# EasyEDA Pro project ProPrj_StarrySkyPi_2025-06-18.epro, schematic Schematic1, sheets 6 to 7 of 7

## Sheets
6 外部存储: Page Name: 外部存储
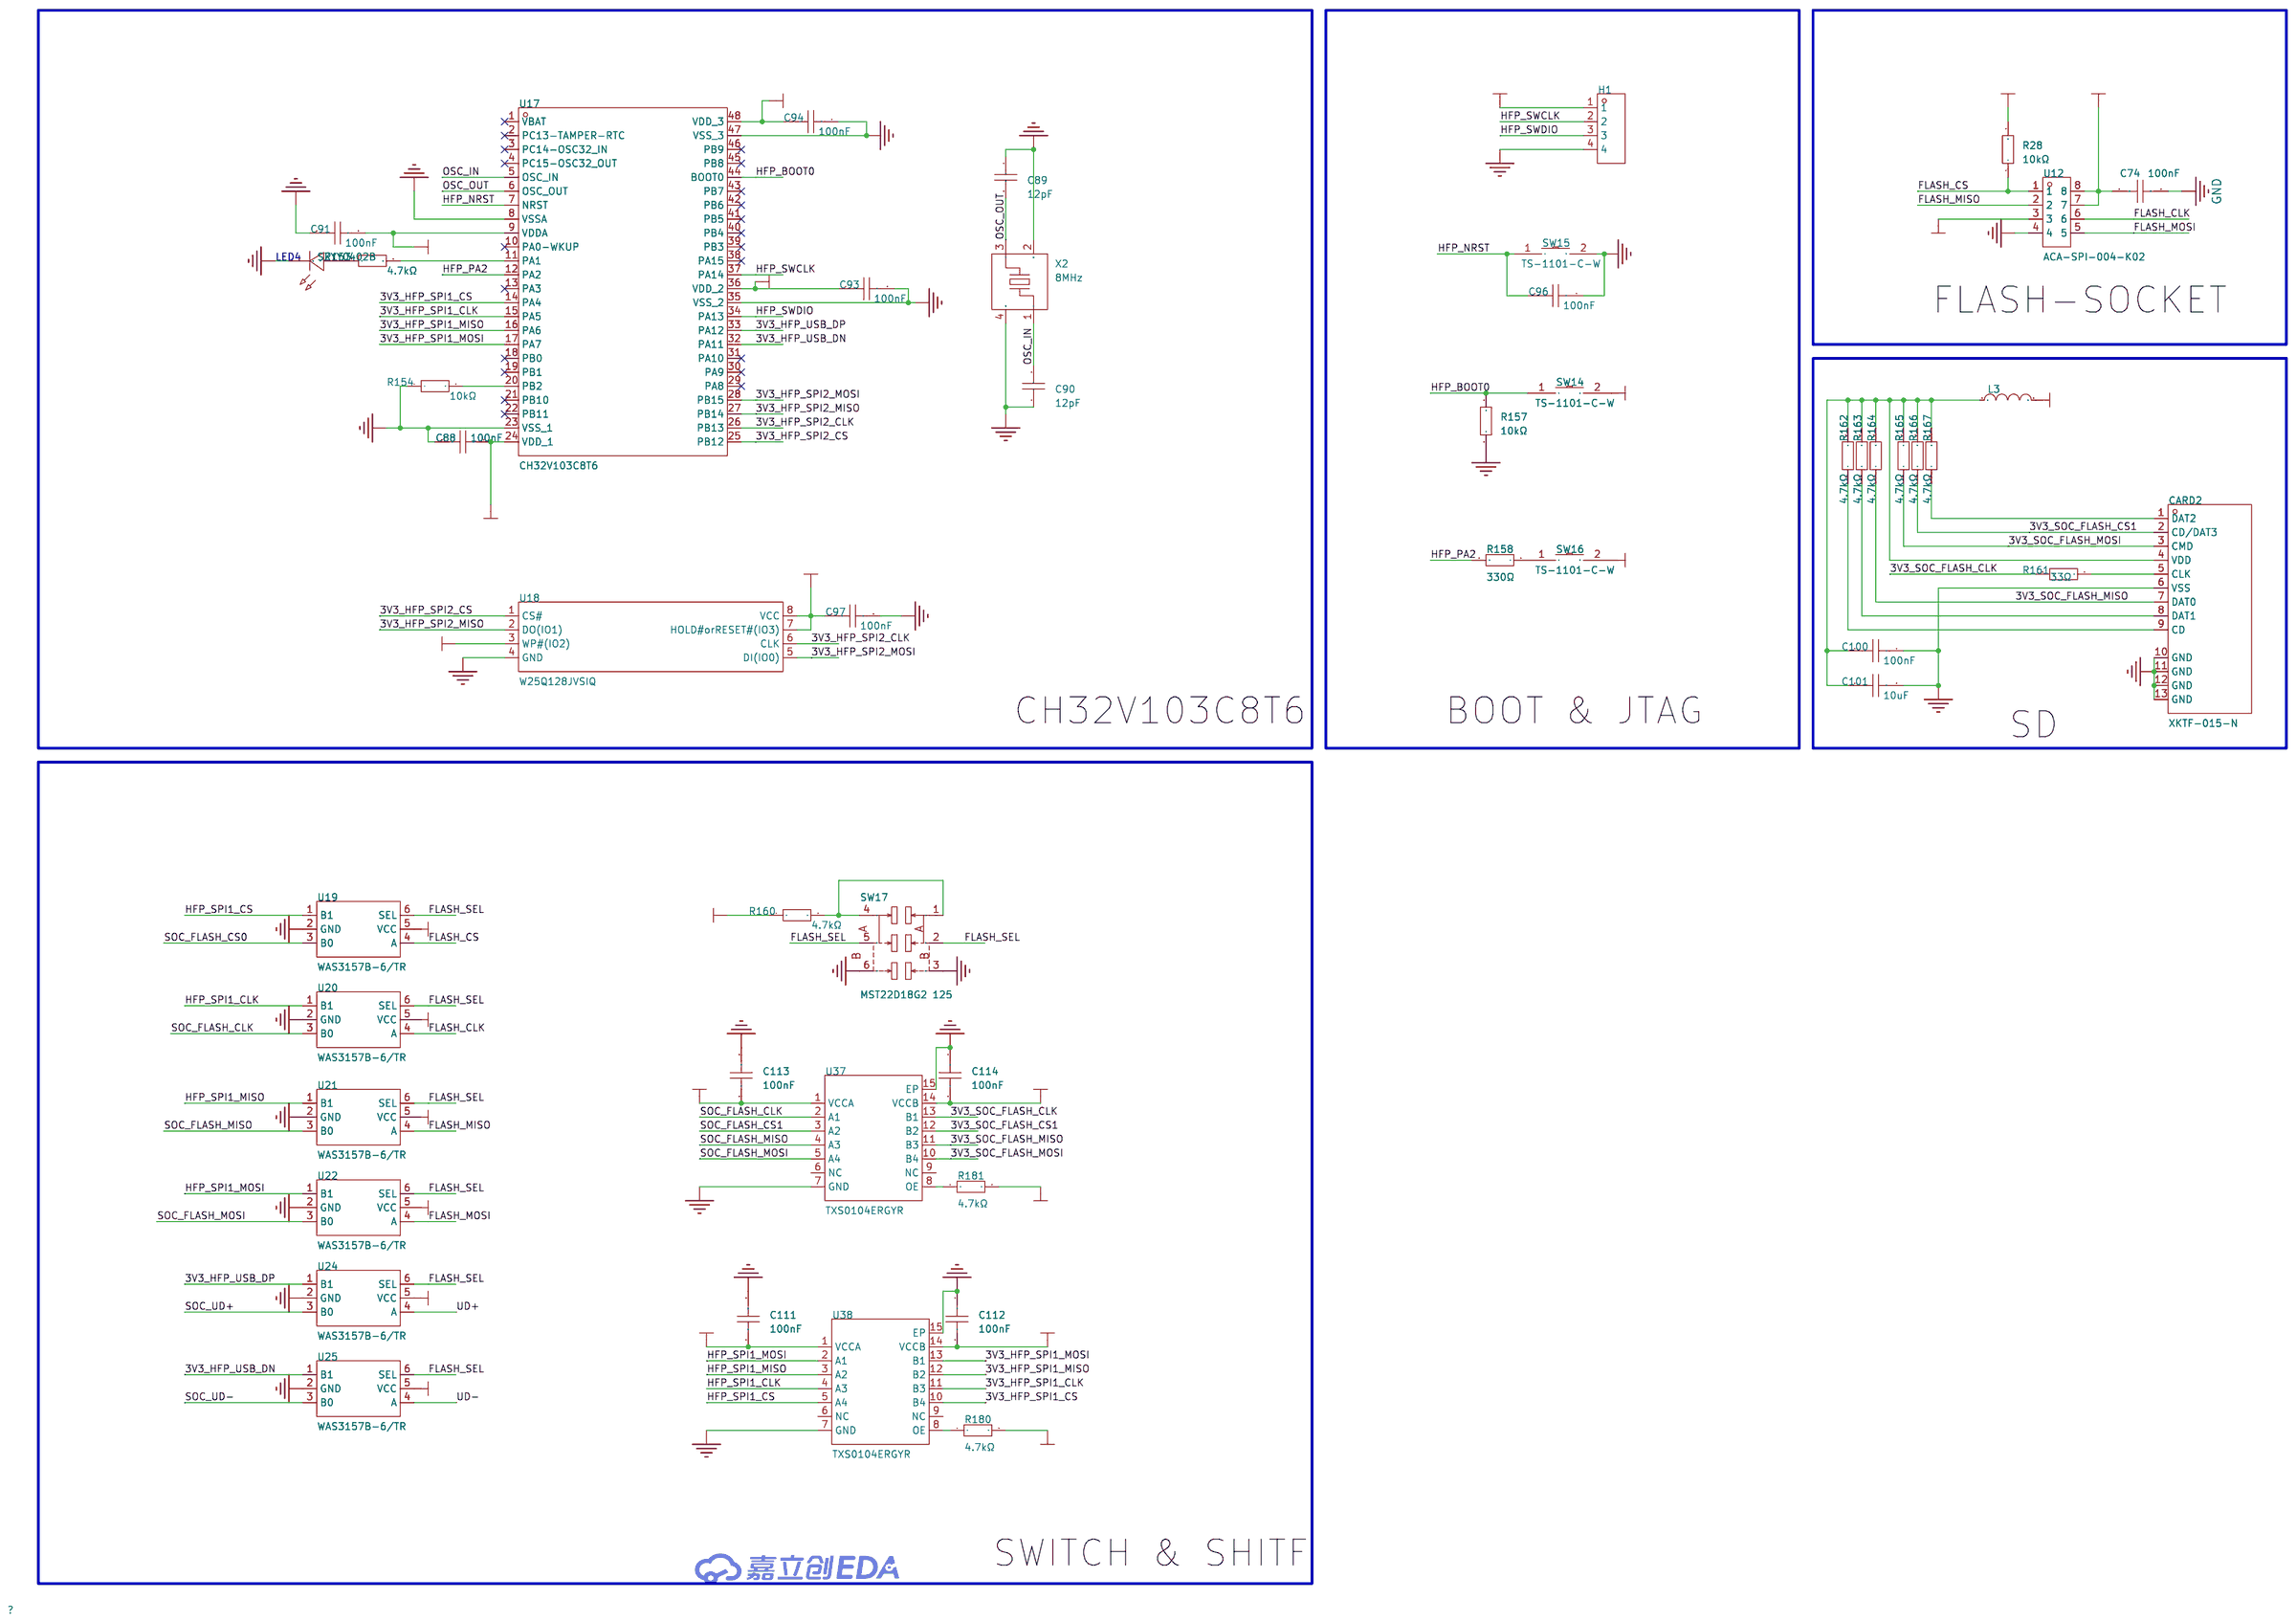
[diagram p5: 外部存储]
7 外设: Page Name: 外设; Update Date: 2025-06-11
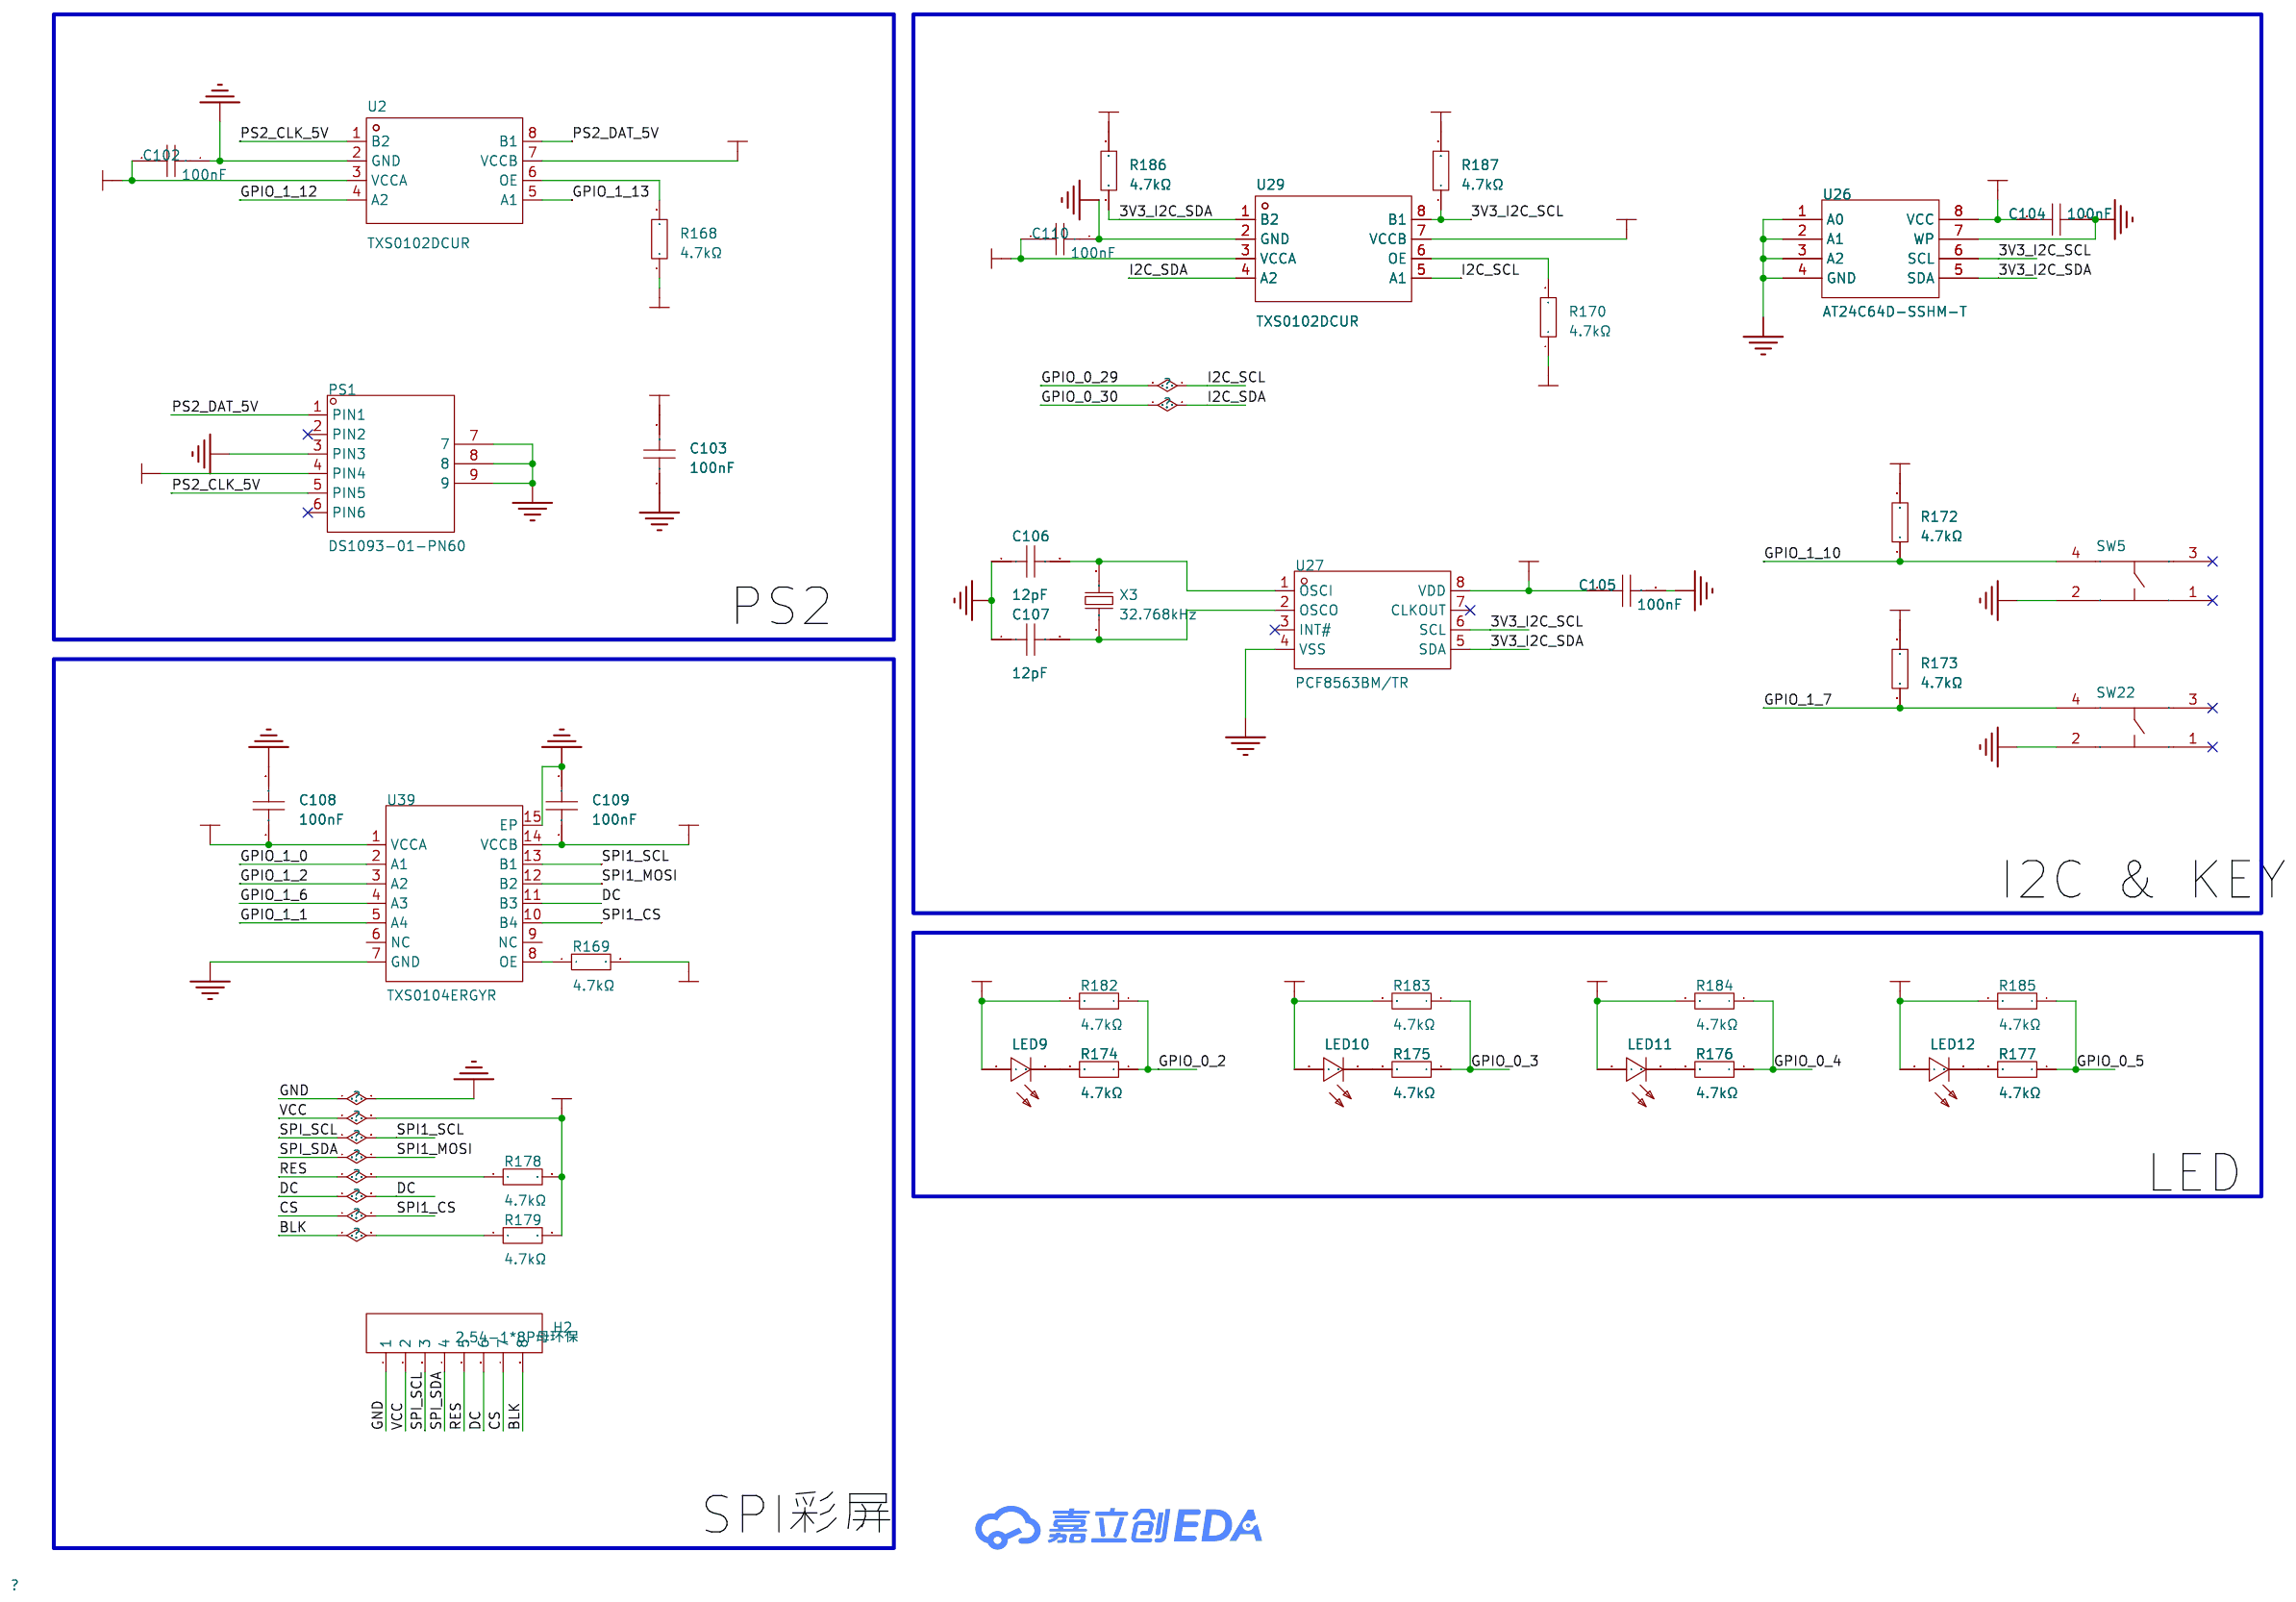
[diagram p6: 外设]

## Parts
sheet 外设
C102  100nF  [C0402]
C103  100nF  [C0402]
C104  100nF  [C0402]
C105  100nF  [C0402]
C106  12pF  [C0402]
C107  12pF  [C0402]
C108  100nF  [C0201]
C109  100nF  [C0201]
C110  100nF  [C0402]
H2  2.54-1*8P母环保  [HDR-TH_8P-P2.54-V-F-1]
LED9  19-213/Y2C-CQ2R2L/3T(CY)  [LED0603-RD-YELLOW]
LED10  19-213/Y2C-CQ2R2L/3T(CY)  [LED0603-RD-YELLOW]
LED11  19-213/Y2C-CQ2R2L/3T(CY)  [LED0603-RD-YELLOW]
LED12  19-213/Y2C-CQ2R2L/3T(CY)  [LED0603-RD-YELLOW]
PS1  DS1093-01-PN60  [CONN-TH_DS1093-01-PN60]
R168  4.7kΩ  [R0402]
R169  4.7kΩ  [R0201]
R170  4.7kΩ  [R0402]
R172  4.7kΩ  [R0402]
R173  4.7kΩ  [R0402]
R174  4.7kΩ  [R0402]
R175  4.7kΩ  [R0402]
R176  4.7kΩ  [R0402]
R177  4.7kΩ  [R0402]
R178  4.7kΩ  [R0201]
R179  4.7kΩ  [R0201]
R182  4.7kΩ  [R0402]
R183  4.7kΩ  [R0402]
R184  4.7kΩ  [R0402]
R185  4.7kΩ  [R0402]
R186  4.7kΩ  [R0402]
R187  4.7kΩ  [R0402]
SW5  PTS810SJM250SMTRLFS  [KEY-SMD_4P-L4.2-W3.2-P2.20-LS4.6]
SW22  PTS810SJM250SMTRLFS  [KEY-SMD_4P-L4.2-W3.2-P2.20-LS4.6]
U2  TXS0102DCUR  [VSON8_L2.0-W2.3-P0.50-LS3.1-BL]
U26  AT24C64D-SSHM-T  [SOIC-8_L5.0-W4.0-P1.27-LS6.0-BL]
U27  PCF8563BM/TR  [SOP-8_L4.9-W3.9-P1.27-LS6.0-BL]
U29  TXS0102DCUR  [VSON8_L2.0-W2.3-P0.50-LS3.1-BL]
U39  TXS0104ERGYR  [VQFN-14_L3.5-W3.5-P0.50-BL-EP]
X3  32.768kHz  [FC-135R_L3.2-W1.5]
sheet 外部存储
C74  100nF  [C0603]
C88  100nF  [C0402]
C89  12pF  [C0402]
C90  12pF  [C0402]
C91  100nF  [C0402]
C93  100nF  [C0402]
C94  100nF  [C0402]
C96  100nF  [C0402]
C97  100nF  [C0402]
C100  100nF  [C0402]
C101  10uF  [C0402]
C111  100nF  [C0201]
C112  100nF  [C0201]
C113  100nF  [C0201]
C114  100nF  [C0201]
CARD2  XKTF-015-N  [TF-SMD_XKTF-015-N]
H1  -  [HDR-TH_4P-P2.54-V-F]
L3  CBW201209U601T  [L0805]
LED4  SZYY0402B  [LED0402-RD_BLUE]
R28  10kΩ  [R0603]
R153  4.7kΩ  [R0603]
R154  10kΩ  [R0402]
R157  10kΩ  [R0603]
R158  330Ω  [R0603]
R160  4.7kΩ  [R0603]
R161  33Ω  [R0402]
R162  4.7kΩ  [R0402]
R163  4.7kΩ  [R0402]
R164  4.7kΩ  [R0402]
R165  4.7kΩ  [R0402]
R166  4.7kΩ  [R0402]
R167  4.7kΩ  [R0402]
R180  4.7kΩ  [R0201]
R181  4.7kΩ  [R0201]
SW14  TS-1101-C-W  [SW-SMD_L6.0-W3.3-LS8.0]
SW15  TS-1101-C-W  [SW-SMD_L6.0-W3.3-LS8.0]
SW16  TS-1101-C-W  [SW-SMD_L6.0-W3.3-LS8.0]
SW17  MST22D18G2 125  [SW-SMD_MST22D18G2]
U12  ACA-SPI-004-K02  [CONN-SMD_ACA-SPI-004-K02]
U17  CH32V103C8T6  [LQFP-48_48P-L7.0-W7.0-P0.50-LS9.0-BL]
U18  W25Q128JVSIQ  [SOIC-8_L5.3-W5.3-P1.27-LS8.0-BL]
U19  WAS3157B-6/TR  [SOT-363_L2.0-W1.3-P0.65-LS2.1-BL]
U20  WAS3157B-6/TR  [SOT-363_L2.0-W1.3-P0.65-LS2.1-BL]
U21  WAS3157B-6/TR  [SOT-363_L2.0-W1.3-P0.65-LS2.1-BL]
U22  WAS3157B-6/TR  [SOT-363_L2.0-W1.3-P0.65-LS2.1-BL]
U24  WAS3157B-6/TR  [SOT-363_L2.0-W1.3-P0.65-LS2.1-BL]
U25  WAS3157B-6/TR  [SOT-363_L2.0-W1.3-P0.65-LS2.1-BL]
U37  TXS0104ERGYR  [VQFN-14_L3.5-W3.5-P0.50-BL-EP]
U38  TXS0104ERGYR  [VQFN-14_L3.5-W3.5-P0.50-BL-EP]
X2  8MHz  [CRYSTAL-SMD_4P-L3.2-W2.5-BL]

## Library data of the parts
C96 C97 C100 C102-C105 C110 = CL05B104KO5NNNC: 容值:100nF;精度:±10%;额定电压:16V;材质(温度系数):X7R;; LCSC Part Name: 100nF ±10% 16V; Supplier Part: C1525; Manufacturer: SAMSUNG(三星); Supplier Footprint: 0402; JLCPCB Part Class: Basic Part; Datasheet: https://atta.szlcsc.com/upload/public/pdf/source/20160218/1457707763339.pdf; Supplier: LCSC; Tolerance: ±10%; Voltage Rated: 16V; Temperature Coefficient: X7R
C106 C107 = GRM1555C1H120JA01D: 容值:12pF;精度:±5%;额定电压:50V;温度系数:C0G;; LCSC Part Name: 12pF ±5% 50V; Supplier Part: C76948; Manufacturer: muRata(村田); Supplier Footprint: 0402; JLCPCB Part Class: Extended Part; Datasheet: https://atta.szlcsc.com/upload/public/pdf/source/20180307/C76948_15204091175261407736.pdf; Supplier: LCSC; Tolerance: ±5%; Voltage Rated: 50V; Temperature Coefficient: C0G; Voltage Rating: 50V
C108 C109 C111-C114 = GRM033R61E104KE14D: 容值:100nF;精度:±10%;额定电压:25V;材质(温度系数):X5R;; LCSC Part Name: 100nF ±10% 25V; Supplier Part: C76939; Manufacturer: muRata(村田); Supplier Footprint: 0201; JLCPCB Part Class: Extended Part; Datasheet: https://atta.szlcsc.com/upload/public/pdf/source/20180307/C76939_15204091018551407727.pdf; Supplier: LCSC; Tolerance: ±10%; Voltage Rated: 25V; Temperature Coefficient: X5R
H2 = 2.54-1*8P母环保: 插孔结构:1x8P;间距:2.54mm;行距:-;安装类型:直插;排数:单排;总孔位数:8P;塑高:-;触头材质:-;触头镀层:-;; LCSC Part Name: 间距:2.54mm 1x8P 直插; Supplier Part: C27438; Manufacturer: BOOMELE(博穆精密); Supplier Footprint: 插件,P=2.54mm; JLCPCB Part Class: Extended Part; Datasheet: https://atta.szlcsc.com/upload/public/pdf/source/20231221/1CA800C6799ED97958773716FAA1BFFE.pdf; Supplier: LCSC; Holes Structure: 1x8P; Pitch: 2.54mm; Mounting Type: 直插; Number of Rows: 单排; Number of Holes: 8P
LED9-LED12 = 19-213/Y2C-CQ2R2L/3T(CY): 发光颜色:黄色;功率:60mW;正向电流:20mA;主波长:585.5nm~591.5nm;二极管配置:-;透镜颜色:无色透明透镜;色温:-;发光角度:120°;载带方式:-;工作温度:-40℃~+85℃;; LCSC Part Name: 黄灯; Supplier Part: C72038; Manufacturer: EVERLIGHT(亿光); Supplier Footprint: 0603; JLCPCB Part Class: 基础库; Datasheet: https://atta.szlcsc.com/upload/public/pdf/source/20160507/1462613613586.pdf; Supplier: LCSC; Emitted Color: 黄色; Power Dissipation: 60mW; Forward Current: 20mA; Dominant Wavelength: 585.5nm~591.5nm; Peak Wavelength: 591nm; Lens Color: 无色透明透镜; Viewing Angle: 120°; Operating Temperature: -40℃~+85℃
PS1 = DS1093-01-PN60: LCSC Part Name: PS2鼠标插座 6Pin  紫色; Supplier Part: C77848; Manufacturer: CONNFLY; Supplier Footprint: 插件; JLCPCB Part Class: 扩展库; Datasheet: https://atta.szlcsc.com/upload/public/pdf/source/20160816/1471343007546.pdf; Supplier: LCSC
R162-R168 R170 R172-R177 R182-R187 = 0402WGF4701TCE: 电阻类型:厚膜电阻;阻值:4.7kΩ;精度:±1%;功率:62.5mW;最大工作电压:50V;温度系数:±100ppm/℃;; LCSC Part Name: 4.7kΩ ±1% 62.5mW 厚膜电阻; Supplier Part: C25900; Manufacturer: UNI-ROYAL(厚声); Supplier Footprint: 0402; JLCPCB Part Class: Basic Part; Datasheet: https://atta.szlcsc.com/upload/public/pdf/source/20200306/C422600_1E6D84923E4A46A82E41ADD87F860B5C.pdf; Supplier: LCSC; Type: 厚膜电阻; Tolerance: ±1%; Power(Watts): 62.5mW; Overload Voltage (Max): 50V; Temperature Coefficient: ±100ppm/℃; Operating Temperature Range: -55℃~+155℃
R169 R178-R181 = 0201WMF4701TEE: 电阻类型:厚膜电阻;阻值:4.7kΩ;精度:±1%;功率:50mW;最大工作电压:25V;温度系数:±200ppm/℃;; LCSC Part Name: 4.7kΩ ±1% 50mW 厚膜电阻; Supplier Part: C270346; Manufacturer: UNI-ROYAL(厚声); Supplier Footprint: 0201; JLCPCB Part Class: Extended Part; Datasheet: https://atta.szlcsc.com/upload/public/pdf/source/20200306/C422600_1E6D84923E4A46A82E41ADD87F860B5C.pdf; Supplier: LCSC; Type: 厚膜电阻; Tolerance: ±1%; Power(Watts): 50mW; Overload Voltage (Max): 25V; Temperature Coefficient: ±200ppm/℃; Operating Temperature Range: -55℃~+155℃
SW5 SW22 = PTS810SJM250SMTRLFS: 电路结构:单刀单掷;按钮形状:圆形按钮;作用力:1.6N;安装方式:立贴;开关长度:4.2mm;开关宽度:3.2mm;开关高度:2.5mm;触点电流:50mA;额定电压(DC):16V;带灯:-;机械寿命:-;; LCSC Part Name: 4.2*3.2*2.5mm 立贴 轻触开关; Supplier Part: C116501; Manufacturer: C&K; Supplier Footprint: SMD; JLCPCB Part Class: Extended Part; Datasheet: https://atta.szlcsc.com/upload/public/pdf/source/20180613/C221897_9316320DEFA4333FA0E6C5D565B0D5EA.pdf; Supplier: LCSC; Circuit: 单刀单掷; Actuator Style: 圆形按钮; Operating Force: 1.6N; Mounting Style: 立贴; Switch Length: 4.2mm; Switch Width: 3.2mm; Switch Height: 2.5mm; Contact Current: 50mA; Voltage Rating (DC): 16V; Pin Style: J型引脚; Operating Temperature: -40℃~+85℃
U2 U29 = TXS0102DCUR: 数据速率:24Mbps;电压(VCCA):1.65V~3.6V;电压(VCCB):2.3V~5.5V;电路数:1;每个电路通道数:2;; LCSC Part Name: 24Mbps 2位双向电平转换器; Supplier Part: C53434; Manufacturer: TI(德州仪器); Supplier Footprint: VSSOP-8; JLCPCB Part Class: 扩展库; Datasheet: https://www.ti.com/cn/lit/gpn/txs0102; Supplier: LCSC; Channel Type: 双向; Data Rate: 24Mbps; Supply Voltage (VCCA): 1.65V~3.6V; Supply Voltage (VCCB): 2.3V~5.5V; Number of Circuits: 1; Channels per Circuit: 2; Output Type: 开路漏极；推挽式; Operating Temperature: -40℃~+85℃; Features: 自动方向检测
U26 = AT24C64D-SSHM-T: 接口类型:I2C;存储容量:64Kbit;; Supplier Part: C6487; Manufacturer: MICROCHIP(美国微芯); Supplier Footprint: SOIC-8; JLCPCB Part Class: 扩展库; Datasheet: https://atta.szlcsc.com/upload/public/pdf/source/20150124/1457707264683.pdf; Supplier: LCSC; Interface Type: I2C; Memory Size: 64Kbit; Supply Voltage: 1.7V~5.5V; Operating Temperature: -40℃~+85℃
U27 = PCF8563BM/TR: Supplier Part: C5116334; Manufacturer: HGSEMI(华冠); Supplier Footprint: SOP-8; JLCPCB Part Class: 扩展库; Datasheet: https://atta.szlcsc.com/upload/public/pdf/source/20220822/3E6CA443E66F300D2C1AD287348F18D3.pdf; Supplier: LCSC
U37-U39 = TXS0104ERGYR: TXS0104E 用于漏极开路应用的 4 位双向电压电平转换器; Supplier Part: C154926; Manufacturer: TI(德州仪器); Supplier Footprint: VQFN-14-EP(3.5x3.5); JLCPCB Part Class: 扩展库; Datasheet: https://www.ti.com/cn/lit/gpn/txs0104e; Supplier: LCSC
X3 = Q13FC13500004_C32346: 晶振类型:贴片晶振;频率:32.768kHz;常温频差:±20ppm;负载电容:12.5pF;; LCSC Part Name: 32.768kHz ±20ppm 12.5pF; Supplier Part: C32346; Manufacturer: EPSON(爱普生); Manufacturer Part: Q13FC13500004; Supplier Footprint: SMD3215-2P; JLCPCB Part Class: 基础库; Datasheet: https://atta.szlcsc.com/upload/public/pdf/source/20240418/0E0FF5F0356BA3753F616001439D1416.pdf; Supplier: LCSC; Crystal Type: 贴片晶振; Normal temperature Frequency Tolerance: ±20ppm; Load Capacitor: 12.5pF; Equivalent Series Resistance (ESR): 70kΩ; Operating Temperature: -40℃~+85℃
C74 = CC0603KRX7R9BB104: 容值:100nF;精度:±10%;额定电压:50V;材质(温度系数):X7R;; LCSC Part Name: 100nF ±10% 50V; Supplier Part: C14663; Manufacturer: YAGEO(国巨); Supplier Footprint: 0603; JLCPCB Part Class: Basic Part; Datasheet: https://atta.szlcsc.com/upload/public/pdf/source/20180910/C282072_33301C7F631E79921B82A8DAC6BCC5B3.pdf; Supplier: LCSC; Tolerance: ±10%; Voltage Rated: 50V; Temperature Coefficient: X7R
C88 C91 C93 C94 = CC0402KRX7R7BB104: 容值:100nF;精度:±10%;额定电压:16V;材质(温度系数):X7R;; LCSC Part Name: 100nF ±10% 16V; Supplier Part: C60474; Manufacturer: YAGEO(国巨); Supplier Footprint: 0402; JLCPCB Part Class: Extended Part; Datasheet: https://atta.szlcsc.com/upload/public/pdf/source/20211223/9278FD768280B81DDBEF48FA36411A03.pdf; Supplier: LCSC; Tolerance: ±10%; Voltage Rated: 16V; Temperature Coefficient: X7R
C89 C90 = GRM1555C1H120JA01D: 容值:12pF;精度:±5%;额定电压:50V;材质(温度系数):C0G;; LCSC Part Name: 12pF ±5% 50V; Supplier Part: C76948; Manufacturer: muRata(村田); Supplier Footprint: 0402; JLCPCB Part Class: 扩展库; Datasheet: https://atta.szlcsc.com/upload/public/pdf/source/20180307/C76948_15204091175261407736.pdf; Supplier: LCSC; Tolerance: ±5%; Voltage Rated: 50V; Temperature Coefficient: C0G
C101 = CL05A106MQ5NUNC: 容值:10uF;精度:±20%;额定电压:6.3V;材质(温度系数):X5R;; LCSC Part Name: 10uF ±20% 6.3V; Supplier Part: C15525; Manufacturer: SAMSUNG(三星); Supplier Footprint: 0402; JLCPCB Part Class: Basic Part; Datasheet: https://atta.szlcsc.com/upload/public/pdf/source/20220823/2B02EE04F8F211D38A52DCB16EB6BEBA.pdf; Supplier: LCSC; Tolerance: ±20%; Voltage Rated: 6.3V; Temperature Coefficient: X5R
CARD2 = XKTF-015-N: 卡连接方式:自弹式;卡类型:MicroSD卡(TF卡);连接器类型:卡座;本体最大高度:2mm;工作温度范围:-25℃~+90℃;; LCSC Part Name: 自弹式 MicroSD卡(TF卡) 卡座; Supplier Part: C381082; Manufacturer: XKB Connection(中国星坤); Supplier Footprint: SMD; JLCPCB Part Class: 扩展库; Datasheet: https://atta.szlcsc.com/upload/public/pdf/source/20211011/66E84C7106D817B4016DBCE6B64BEDA0.pdf; Supplier: LCSC; Card Connection Mode: 自弹式; Card Type: MicroSD卡(TF卡); Connector Type: 卡座; Maximum Body Height: 2mm; Operating Temperature Range: -25℃~+90℃
H1 = HDR-F_2.54_1x4P: Supplier Part: C2718488; Supplier Footprint: 插件
L3 = CBW201209U601T: 标称阻抗@测试频率:600Ω@100MHz;误差:±25%;直流电阻(RDC):250mΩ;; LCSC Part Name: 单路 0805磁珠 阻抗600Ω@100MHz; Supplier Part: C21286; Manufacturer: FH(风华); Supplier Footprint: 0805; JLCPCB Part Class: 扩展库; Datasheet: https://atta.szlcsc.com/upload/public/pdf/source/20190129/C361676_507080CDC8DBC2B0B7C2139C1873642D.pdf; Supplier: LCSC; Impedance @ Frequency: 600Ω@100MHz; Tolerance: ±25%; DC Resistance: 250mΩ; Current Rating: 1.5A; Circuits: 1
LED4 = SZYY0402B: 发光颜色:蓝色;功率:-;正向电流:5mA;主波长:466nm~469nm;色温:-;发光角度:120°;载带方式:-;工作温度:-40℃~+85℃;; LCSC Part Name: 蓝灯; Supplier Part: C434447; Manufacturer: yongyu(永裕光电); Supplier Footprint: 0402; JLCPCB Part Class: Extended Part; Datasheet: https://atta.szlcsc.com/upload/public/pdf/source/20210222/C434447_30232BB6183B52026028ECA50B9DAB35.pdf; Supplier: LCSC; Emitted Color: 蓝色; Forward Current: 5mA; Dominant Wavelength: 466nm~469nm; Viewing Angle: 120°; Operating Temperature: -40℃~+85℃
R28 R157 = 0603WAF1002T5E: 电阻类型:厚膜电阻;阻值:10kΩ;精度:±1%;功率:100mW;最大工作电压:75V;温度系数:±100ppm/℃;; LCSC Part Name: 厚膜电阻 10kΩ ±1% 100mW; Supplier Part: C25804; Manufacturer: UNI-ROYAL(厚声); Supplier Footprint: 0603; JLCPCB Part Class: Basic Part; Datasheet: https://atta.szlcsc.com/upload/public/pdf/source/20200306/C422600_1E6D84923E4A46A82E41ADD87F860B5C.pdf; Supplier: LCSC; Type: 厚膜电阻; Tolerance: ±1%; Power(Watts): 100mW; Overload Voltage (Max): 75V; Temperature Coefficient: ±100ppm/℃; Operating Temperature Range: -55℃~+155℃
R153 R160 = 0603WAF4701T5E: 电阻类型:厚膜电阻;阻值:4.7kΩ;精度:±1%;功率:100mW;最大工作电压:75V;温度系数:±100ppm/℃;; LCSC Part Name: 4.7kΩ ±1% 100mW 厚膜电阻; Supplier Part: C23162; Manufacturer: UNI-ROYAL(厚声); Supplier Footprint: 0603; JLCPCB Part Class: Basic Part; Datasheet: https://atta.szlcsc.com/upload/public/pdf/source/20200306/C422600_1E6D84923E4A46A82E41ADD87F860B5C.pdf; Supplier: LCSC; Type: 厚膜电阻; Tolerance: ±1%; Power(Watts): 100mW; Overload Voltage (Max): 75V; Temperature Coefficient: ±100ppm/℃; Operating Temperature Range: -55℃~+155℃
R154 = 0402WGF1002TCE: 电阻类型:厚膜电阻;阻值:10kΩ;精度:±1%;功率:62.5mW;最大工作电压:50V;温度系数:±100ppm/℃;; LCSC Part Name: 10kΩ ±1% 62.5mW 厚膜电阻; Supplier Part: C25744; Manufacturer: UNI-ROYAL(厚声); Supplier Footprint: 0402; JLCPCB Part Class: Basic Part; Datasheet: https://atta.szlcsc.com/upload/public/pdf/source/20200306/C422600_1E6D84923E4A46A82E41ADD87F860B5C.pdf; Supplier: LCSC; Type: 厚膜电阻; Tolerance: ±1%; Power(Watts): 62.5mW; Overload Voltage (Max): 50V; Temperature Coefficient: ±100ppm/℃; Operating Temperature Range: -55℃~+155℃
R158 = 0603WAF3300T5E: 电阻类型:厚膜电阻;阻值:330Ω;精度:±1%;功率:100mW;最大工作电压:75V;温度系数:±100ppm/℃;; LCSC Part Name: 330Ω ±1% 100mW 厚膜电阻; Supplier Part: C23138; Manufacturer: UNI-ROYAL(厚声); Supplier Footprint: 0603; JLCPCB Part Class: Basic Part; Datasheet: https://atta.szlcsc.com/upload/public/pdf/source/20200306/C422600_1E6D84923E4A46A82E41ADD87F860B5C.pdf; Supplier: LCSC; Type: 厚膜电阻; Tolerance: ±1%; Power(Watts): 100mW; Overload Voltage (Max): 75V; Temperature Coefficient: ±100ppm/℃; Operating Temperature Range: -55℃~+155℃
R161 = 0402WGF330JTCE: 电阻类型:厚膜电阻;阻值:33Ω;精度:±1%;功率:62.5mW;最大工作电压:50V;温度系数:±100ppm/℃;; LCSC Part Name: 33Ω ±1% 62.5mW 厚膜电阻; Supplier Part: C25105; Manufacturer: UNI-ROYAL(厚声); Supplier Footprint: 0402; JLCPCB Part Class: Basic Part; Datasheet: https://atta.szlcsc.com/upload/public/pdf/source/20200306/C422600_1E6D84923E4A46A82E41ADD87F860B5C.pdf; Supplier: LCSC; Type: 厚膜电阻; Tolerance: ±1%; Power(Watts): 62.5mW; Overload Voltage (Max): 50V; Temperature Coefficient: ±100ppm/℃; Operating Temperature Range: -55℃~+155℃
SW14-SW16 = TS-1101-C-W: 电路结构:单刀单掷;按钮形状:矩形按钮;作用力:260gf;安装方式:立贴;开关长度:6mm;开关宽度:3.6mm;开关高度:2.5mm;带支架:不带;触点电流:50mA;额定电压(AC):-;额定电压(DC):12V;额定功率:-;绝缘电阻:-;带灯:无;机械寿命:5万次;; LCSC Part Name: 6*3.6*2.5mm 立贴 轻触开关; Supplier Part: C318938; Manufacturer: XKB Connectivity(中国星坤); Supplier Footprint: SMD; JLCPCB Part Class: 扩展库; Datasheet: https://atta.szlcsc.com/upload/public/pdf/source/20200227/C318938_C2E53B1EEDE37D980A33616AC086DE53.pdf; Supplier: LCSC; Circuit: 单刀单掷; Actuator Style: 矩形按钮; Operating Force: 260gf; Mounting Style: 立贴; Switch Length: 6mm; Switch Width: 3.6mm; Switch Height: 2.5mm; Strike Gundam: 不带; Contact Current: 50mA; Voltage Rating (DC): 12V; Actuator/Cap Color: 白色带淡绿; With Lamp: 无; Mechanical Life: 5万次; Operating Temperature: -30℃~+85℃
SW17 = MST22D18G2 125: 电路结构:双刀双掷;安装方式:立贴;开关颜色:黑色;额定电流(DC):100mA;额定电压(DC):12V;机械寿命:1万次;; LCSC Part Name: 拨动开关/两档立式 6脚贴片 柄长2.0mm 大六立贴 9.1*3.5mm; Supplier Part: C2906280; Manufacturer: SHOU HAN(首韩); Supplier Footprint: SMD; JLCPCB Part Class: 扩展库; Datasheet: https://atta.szlcsc.com/upload/public/pdf/source/20211019/449AD4EDF23AADA7A5C4E3C063EDBB30.pdf; Supplier: LCSC; Circuit: 双刀双掷; Pin Style: 鸥翼型; Mounting Style: 立贴; Actuator Color: 黑色; Current Rating (DC): 100mA; Voltage Rating (DC): 12V; Mechanical Life: 1万次; Operating Temperature: -25℃~+70℃
U12 = ACA-SPI-004-K02: LCSC Part Name: SPI 连接器; Supplier Part: C962129; Manufacturer: LOTES(嘉澤端子); JLCPCB Part Class: 扩展库; Datasheet: https://atta.szlcsc.com/upload/public/pdf/source/20201125/C962129_3BCCA5D90998541809E80F476B537BA8.pdf; Supplier: LCSC
U17 = CH32V103C8T6: CPU内核:RISC-V;程序存储容量:64KB;RAM总容量:20KB;GPIO端口数量:37;工作电压范围:2.7V~5.5V;CPU最大主频:80MHz;程序存储器类型:FLASH;; Supplier Part: C2764428; Manufacturer: WCH(南京沁恒); Supplier Footprint: LQFP-48(7x7); JLCPCB Part Class: 扩展库; Datasheet: https://atta.szlcsc.com/upload/public/pdf/source/20210707/C2832145_C97F3FA8145C3B839C9866ABB94A77A4.pdf; Supplier: LCSC; CPU Core: RISC-V; Program Storage Size: 64KB; RAM Size: 20KB; GPIO Ports Number: 37; Operating Voltage Range: 2.7V~5.5V; CPU Maximum Speed: 80MHz; Program Memory Type: FLASH; Operating Temperature Range: -40℃~+85℃; ADC (Bit): 12bit; PWM (Bit): 16bit; 16Bit Timer: 4; UART/USART: 3; I2C: 2; SPI: 2; Internal Oscillator: 有
U18 = W25Q128JVSIQ_C113767: 接口类型:SPI;存储容量:128Mbit;; Supplier Part: C113767; Manufacturer: WINBOND(华邦); Supplier Footprint: SOIC-8-208mil; JLCPCB Part Class: 扩展库; Datasheet: https://atta.szlcsc.com/upload/public/pdf/source/20180329/C113767_097B64D788F6E3FFB2E9CB46CB6C1427.pdf; Supplier: LCSC; Interface: SPI; Memory Size: 128Mbit; Voltage - Supply: 2.7V~3.6V; Page Programming Time (Tpp): 3ms; Operating Temperature: -40℃~+85℃
U19-U22 U24 U25 = WAS3157B-6/TR: 开关电路:单刀双掷(SPDT);通道数:-;导通电阻:5.5Ω;; Supplier Part: C213161; Manufacturer: WILLSEMI(韦尔); Supplier Footprint: SOT-363; JLCPCB Part Class: 扩展库; Datasheet: https://atta.szlcsc.com/upload/public/pdf/source/20180420/C213161_6492DDD7A7717D1F18F3D7064F4D413D.pdf; Supplier: LCSC; Switch Circuit: 单刀双掷(SPDT); Voltage - Supply: 2.3V~5.5V; Turn-on time: 120ns; RDS(on): 5.5Ω; Turn-off time: 80ns; Operating Temperature: -40℃~+85℃
X2 = X32258MOB4SI: 晶振类型:贴片晶振;频率:8MHz;常温频差:±10ppm;负载电容:12pF;频率稳定度:±20ppm;; LCSC Part Name: 8MHz ±10ppm 12pF; Supplier Part: C2682775; Manufacturer: YXC(扬兴晶振); Supplier Footprint: SMD3225-4P; JLCPCB Part Class: 扩展库; Datasheet: https://atta.szlcsc.com/upload/public/pdf/source/20240329/19D5F850207469550BEB00D7DFEDBC7A.pdf; Supplier: LCSC; Type: 贴片晶振; Normal temperature Frequency Tolerance: ±10ppm; Load Capacitance: 12pF; Frequency Stability: ±20ppm; Equivalent Series Resistance(ESR): 150Ω; Operating Temperature: -40℃~+85℃

## Nets
3V3_HFP_SPI1_CLK: U17.15(PA5) U38.11(B3)
3V3_HFP_SPI1_CS: U17.14(PA4) U38.10(B4)
3V3_HFP_SPI1_MISO: U17.16(PA6) U38.12(B2)
3V3_HFP_SPI1_MOSI: U17.17(PA7) U38.13(B1)
3V3_HFP_SPI2_CLK: U17.26(PB13) U18.6(CLK)
3V3_HFP_SPI2_CS: U17.25(PB12) U18.1(CS#)
3V3_HFP_SPI2_MISO: U17.27(PB14) U18.2(DO(IO1))
3V3_HFP_SPI2_MOSI: U17.28(PB15) U18.5(DI(IO0))
3V3_HFP_USB_DN: U17.32(PA11) U25.1(B1)
3V3_HFP_USB_DP: U17.33(PA12) U24.1(B1)
3V3_I2C_SCL: R187.1 U26.6(SCL) U27.6(SCL) U29.8(B1)
3V3_I2C_SDA: R186.1 U26.5(SDA) U27.5(SDA) U29.1(B2)
3V3_SOC_FLASH_CLK: R161.2 U37.13(B1)
3V3_SOC_FLASH_CS1: CARD2.2(CD/DAT3) R166.1 U37.12(B2)
3V3_SOC_FLASH_MISO: CARD2.7(DAT0) R164.1 U37.11(B3)
3V3_SOC_FLASH_MOSI: CARD2.3(CMD) R165.1 U37.10(B4)
GND: C74.1 C88.2 C89.1 C90.1 C91.1 C93.2 C94.2 C96.2 C97.2 C100.2 C101.2 C102.1 C103.1 C104.1 C105.2 C106.1 C107.1 C108.2 C109.2 C110.1 C111.2 C112.2 C113.2 C114.2 CARD2.6(VSS) CARD2.10(GND) CARD2.11(GND) CARD2.12(GND) CARD2.13(GND) H1.4 H2.1 LED4.1(C) PS1.3(PIN3) PS1.7 PS1.8 PS1.9 R154.1 R157.1 SW5.2 SW15.2 SW17.3 SW17.6 SW22.2 U2.2(GND) U12.4 U17.8(VSSA) U17.23(VSS_1) U17.35(VSS_2) U17.47(VSS_3) U18.4(GND) U19.2(GND) U20.2(GND) U21.2(GND) U22.2(GND) U24.2(GND) U25.2(GND) U26.1(A0) U26.2(A1) U26.3(A2) U26.4(GND) U26.7(WP) U27.4(VSS) U29.2(GND) U37.7(GND) U37.15(EP) U38.7(GND) U38.15(EP) U39.7(GND) U39.15(EP) X2.2(GND) X2.4(GND) ; also on sheet 2 3 4 5
VCC_1V8: C74.2 C102.2 C108.1 C110.2 C111.1 C113.1 R28.2 R168.1 R169.2 R170.1 R172.2 R173.2 R180.2 R181.2 U2.3(VCCA) U12.3 U12.7 U12.8 U29.3(VCCA) U37.1(VCCA) U38.1(VCCA) U39.1(VCCA) ; also on sheet 2 3 4 5
VCC_3V3: C88.1 C91.2 C93.1 C94.1 C97.1 C104.2 C105.1 C109.1 C112.1 C114.1 H1.1 H2.2 L3.2 LED9.2(A) LED10.2(A) LED11.2(A) LED12.2(A) R160.1 R178.2 R179.2 R182.2 R183.2 R184.2 R185.2 R186.2 R187.2 SW14.2 SW16.2 U17.9(VDDA) U17.24(VDD_1) U17.36(VDD_2) U17.48(VDD_3) U18.3(WP#(IO2)) U18.7(HOLD#orRESET#(IO3)) U18.8(VCC) U19.5(VCC) U20.5(VCC) U21.5(VCC) U22.5(VCC) U24.5(VCC) U25.5(VCC) U26.8(VCC) U27.8(VDD) U29.7(VCCB) U37.14(VCCB) U38.14(VCCB) U39.14(VCCB) ; also on sheet 2 4 5
VCC_5V: C103.2 PS1.4(PIN4) U2.7(VCCB) ; also on sheet 2 5
BLK: H2.8 R179.1
CS: H2.7 U39.10(B4)
DC: H2.6 U39.11(B3)
FLASH_CLK: U12.6 U20.4(A)
FLASH_CS: R28.1 U12.1 U19.4(A)
FLASH_MISO: U12.2 U21.4(A)
FLASH_MOSI: U12.5 U22.4(A)
FLASH_SEL: SW17.2 SW17.5 U19.6(SEL) U20.6(SEL) U21.6(SEL) U22.6(SEL) U24.6(SEL) U25.6(SEL)
GPIO_0_2: R174.1 R182.1 ; also on sheet 3
GPIO_0_3: R175.1 R183.1 ; also on sheet 3
GPIO_0_4: R176.1 R184.1 ; also on sheet 3
GPIO_0_5: R177.1 R185.1 ; also on sheet 3
GPIO_0_29: U29.5(A1) ; also on sheet 3
GPIO_0_30: U29.4(A2) ; also on sheet 3
GPIO_1_0: U39.2(A1) ; also on sheet 3
GPIO_1_1: U39.5(A4) ; also on sheet 3
GPIO_1_2: U39.3(A2) ; also on sheet 3
GPIO_1_6: U39.4(A3) ; also on sheet 3
GPIO_1_7: R173.1 SW22.4 ; also on sheet 3
GPIO_1_10: R172.1 SW5.4 ; also on sheet 3
GPIO_1_12: U2.4(A2) ; also on sheet 3
GPIO_1_13: U2.5(A1) ; also on sheet 3
HFP_BOOT0: R157.2 SW14.1 U17.44(BOOT0)
HFP_NRST: C96.1 SW15.1 U17.7(NRST)
HFP_PA2: R158.2 U17.12(PA2)
HFP_SPI1_CLK: U20.1(B1) U38.4(A3)
HFP_SPI1_CS: U19.1(B1) U38.5(A4)
HFP_SPI1_MISO: U21.1(B1) U38.3(A2)
HFP_SPI1_MOSI: U22.1(B1) U38.2(A1)
HFP_SWCLK: H1.2 U17.37(PA14)
HFP_SWDIO: H1.3 U17.34(PA13)
OSC_IN: C90.2 U17.5(OSC_IN) X2.1
OSC_OUT: C89.2 U17.6(OSC_OUT) X2.3
PS2_CLK_5V: PS1.5(PIN5) U2.1(B2)
PS2_DAT_5V: PS1.1(PIN1) U2.8(B1)
RES: H2.5 R178.1
SOC_FLASH_CLK: U20.3(B0) U37.2(A1) ; also on sheet 3
SOC_FLASH_CS0: U19.3(B0) ; also on sheet 3
SOC_FLASH_CS1: U37.3(A2) ; also on sheet 3
SOC_FLASH_MISO: U21.3(B0) U37.4(A3) ; also on sheet 3
SOC_FLASH_MOSI: U22.3(B0) U37.5(A4) ; also on sheet 3
SOC_UD+: U24.3(B0) ; also on sheet 5
SOC_UD-: U25.3(B0) ; also on sheet 5
SPI1_MOSI: H2.4 U39.12(B2)
SPI1_SCL: H2.3 U39.13(B1)
UD+: U24.4(A) ; also on sheet 5
UD-: U25.4(A) ; also on sheet 5
$6N3035: R153.2 U17.11(PA1)
$6N3036: LED4.2(A) R153.1
$6N3048: R154.2 U17.20(PB2)
$6N3081: R158.1 SW16.1
$6N3166: R160.2 SW17.1 SW17.4
$6N3189: CARD2.9(CD) R162.1
$6N3190: CARD2.8(DAT1) R163.1
$6N3191: CARD2.1(DAT2) R167.1
$6N3192: C100.1 C101.1 CARD2.4(VDD) L3.1 R162.2 R163.2 R164.2 R165.2 R166.2 R167.2
$6N3196: CARD2.5(CLK) R161.1
$6N3198: R180.1 U38.8(OE)
$6N3220: R181.1 U37.8(OE)
$7N2325: R168.2 U2.6(OE)
$7N2345: C107.2 U27.2(OSCO) X3.1
$7N2346: C106.2 U27.1(OSCI) X3.2
$7N2348: R169.1 U39.8(OE)
$7N2420: R170.2 U29.6(OE)
$7N2460: LED9.1(C) R174.2
$7N2464: LED10.1(C) R175.2
$7N2468: LED11.1(C) R176.2
$7N2472: LED12.1(C) R177.2

Not connected (* = marked no-connect by the designer): PS1 2(PIN2)* 6(PIN6)*; SW5 1* 3*; SW22 1* 3*; U17 1(VBAT)* 2(PC13-TAMPER-RTC)* 3(PC14-OSC32_IN)* 4(PC15-OSC32_OUT)* 10(PA0-WKUP)* 13(PA3)* 18(PB0)* 19(PB1)* 21(PB10)* 22(PB11)* 29(PA8)* 30(PA9)* 31(PA10)* 38(PA15)* 39(PB3)* 40(PB4)* 41(PB5)* 42(PB6)* 43(PB7)* 45(PB8)* 46(PB9)*; U27 3(INT#)* 7(CLKOUT)*; U37 6(NC) 9(NC); U38 6(NC) 9(NC); U39 6(NC) 9(NC)

## Notes on the sheets
sheet 6
- FLASH-SOCKET
- CH32V103C8T6
- BOOT & JTAG
- SD
- SWITCH & SHITF
sheet 7
- PS2
- I2C & KEY
- LED
- SPI彩屏
